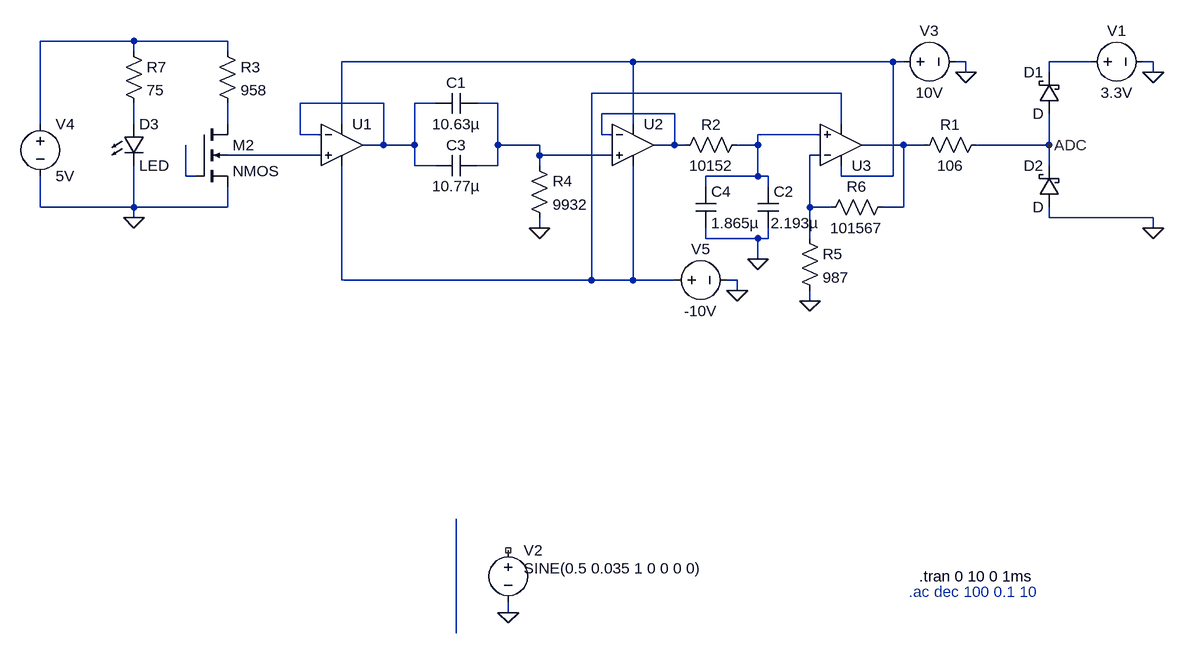
[diagram p0: schematic MeasuredValues_OPB.asc]
MeasuredValues_OPB.asc, the LTspice schematic file:
Version 4.1
SHEET 1 880 836
WIRE -896 -80 -1040 -80
WIRE -752 -80 -896 -80
WIRE -896 -64 -896 -80
WIRE -752 -64 -752 -80
WIRE -128 -48 -576 -48
WIRE 272 -48 -128 -48
WIRE 288 -48 272 -48
WIRE 384 -48 368 -48
WIRE 576 -48 512 -48
WIRE 672 -48 656 -48
WIRE 384 -32 384 -48
WIRE 512 -32 512 -48
WIRE 672 -32 672 -48
WIRE 192 0 -192 0
WIRE -512 16 -640 16
WIRE -432 16 -464 16
WIRE -336 16 -368 16
WIRE -64 32 -176 32
WIRE -1040 48 -1040 -80
WIRE -896 48 -896 16
WIRE -752 48 -752 16
WIRE -576 48 -576 -48
WIRE -128 48 -128 -48
WIRE 192 48 192 0
WIRE -640 64 -640 16
WIRE -608 64 -640 64
WIRE -176 64 -176 32
WIRE -160 64 -176 64
WIRE 160 64 64 64
WIRE -512 80 -512 16
WIRE -512 80 -544 80
WIRE -464 80 -464 16
WIRE -464 80 -512 80
WIRE -336 80 -336 16
WIRE -272 80 -336 80
WIRE -64 80 -64 32
WIRE -64 80 -96 80
WIRE -48 80 -64 80
WIRE 64 80 64 64
WIRE 64 80 32 80
WIRE 288 80 224 80
WIRE 320 80 288 80
WIRE 512 80 512 32
WIRE 512 80 400 80
WIRE -608 96 -752 96
WIRE -272 96 -272 80
WIRE -160 96 -272 96
WIRE 160 96 144 96
WIRE -464 112 -464 80
WIRE -432 112 -464 112
WIRE -336 112 -336 80
WIRE -336 112 -368 112
WIRE -272 112 -272 96
WIRE 512 112 512 80
WIRE -816 128 -816 80
WIRE -800 128 -816 128
WIRE 64 128 64 80
WIRE 64 128 -16 128
WIRE 80 128 64 128
WIRE 192 128 192 112
WIRE 272 128 272 -48
WIRE 272 128 192 128
WIRE -16 144 -16 128
WIRE 80 144 80 128
WIRE -1040 176 -1040 128
WIRE -896 176 -896 112
WIRE -896 176 -1040 176
WIRE -752 176 -752 144
WIRE -752 176 -896 176
WIRE 144 176 144 96
WIRE 176 176 144 176
WIRE 288 176 288 80
WIRE 288 176 256 176
WIRE -896 192 -896 176
WIRE 512 192 512 176
WIRE 672 192 512 192
WIRE -272 208 -272 192
WIRE 672 208 672 192
WIRE -16 224 -16 208
WIRE 64 224 -16 224
WIRE 80 224 80 208
WIRE 80 224 64 224
WIRE 144 224 144 176
WIRE 64 256 64 224
WIRE -576 288 -576 112
WIRE -192 288 -192 0
WIRE -192 288 -576 288
WIRE -128 288 -128 112
WIRE -128 288 -192 288
WIRE -64 288 -128 288
WIRE 32 288 16 288
WIRE 32 304 32 288
WIRE 144 320 144 304
WIRE -320 800 -320 784
WIRE -400 832 -400 656
FLAG 672 208 0
FLAG 672 -32 0
FLAG -272 208 0
FLAG 64 256 0
FLAG 144 320 0
FLAG 512 80 ADC
FLAG 384 -32 0
FLAG 32 304 0
FLAG -320 800 0
FLAG -896 192 0
SYMBOL schottky 528 176 R180
WINDOW 0 24 64 Left 2
WINDOW 3 24 0 Left 2
SYMATTR InstName D2
SYMBOL schottky 528 32 R180
WINDOW 0 24 64 Left 2
WINDOW 3 24 0 Left 2
SYMATTR InstName D1
SYMBOL res 416 64 R90
WINDOW 0 0 56 VBottom 2
WINDOW 3 32 56 VTop 2
SYMATTR InstName R1
SYMATTR Value 106
SYMBOL voltage 560 -48 R270
WINDOW 0 32 56 VTop 2
WINDOW 3 -32 56 VBottom 2
SYMATTR InstName V1
SYMATTR Value 3.3V
SYMBOL voltage -320 688 R0
WINDOW 123 24 124 Left 2
WINDOW 39 0 0 Left 0
WINDOW 3 24 44 Left 2
SYMATTR Value SINE(0.5 0.035 1 0 0 0 0)
SYMATTR InstName V2
SYMBOL OpAmps\\UniversalOpAmp -576 80 R0
SYMATTR InstName U1
SYMBOL OpAmps\\UniversalOpAmp -128 80 R0
SYMATTR InstName U2
SYMBOL res 48 64 R90
WINDOW 0 0 56 VBottom 2
WINDOW 3 32 56 VTop 2
SYMATTR InstName R2
SYMATTR Value 10152
SYMBOL cap -368 0 R90
WINDOW 0 0 32 VBottom 2
WINDOW 3 32 32 VTop 2
SYMATTR InstName C1
SYMATTR Value 10.63µ
SYMBOL res -288 96 R0
SYMATTR InstName R4
SYMATTR Value 9932
SYMBOL cap 64 144 R0
WINDOW 3 20 56 Left 2
SYMATTR InstName C2
SYMATTR Value 2.193µ
SYMBOL OpAmps\\UniversalOpAmp 192 80 M180
SYMATTR InstName U3
SYMBOL res 128 208 R0
SYMATTR InstName R5
SYMATTR Value 987
SYMBOL res 272 160 R90
WINDOW 0 0 56 VBottom 2
WINDOW 3 32 56 VTop 2
SYMATTR InstName R6
SYMATTR Value 101567
SYMBOL voltage 272 -48 R270
WINDOW 0 32 56 VTop 2
WINDOW 3 -32 56 VBottom 2
SYMATTR InstName V3
SYMATTR Value 10V
SYMBOL voltage -80 288 R270
WINDOW 0 32 56 VTop 2
WINDOW 3 -32 56 VBottom 2
SYMATTR InstName V5
SYMATTR Value -10V
SYMBOL cap -368 96 R90
WINDOW 0 0 32 VBottom 2
WINDOW 3 32 32 VTop 2
SYMATTR InstName C3
SYMATTR Value 10.77µ
SYMBOL cap -32 144 R0
SYMATTR InstName C4
SYMATTR Value 1.865µ
SYMBOL LED -912 48 R0
SYMATTR InstName D3
SYMATTR Value LED
SYMBOL res -768 -80 R0
SYMATTR InstName R3
SYMATTR Value 958
SYMBOL res -912 -80 R0
SYMATTR InstName R7
SYMATTR Value 75
SYMBOL voltage -1040 32 R0
SYMATTR InstName V4
SYMATTR Value 5V
SYMBOL nmos4 -800 48 R0
SYMATTR InstName M2
TEXT 312 744 Left 2 !.tran 0 10 0 1ms
TEXT 296 768 Left 2 ;.ac dec 100 0.1 10

The netlist it stands for:
* MeasuredValues_OPB.asc
D2 0 ADC D
D1 ADC N003 D
R1 ADC N011 106
V1 N003 0 3.3V
V2 NC_01 0 SINE(0.5 0.035 1 0 0 0 0)
X§U1 N012 N005 N002 N004 N005 level1 Avol=1Meg GBW=10Meg Vos=0 En=0 Enk=0 In=0 Ink=0 Rin=500Meg  ; pins In+ In- V+ V- OUT
X§U2 N006 N007 N002 N004 N007 level1 Avol=1Meg GBW=10Meg Vos=0 En=0 Enk=0 In=0 Ink=0 Rin=500Meg  ; pins In+ In- V+ V- OUT
R2 N010 N007 10152
C1 N006 N005 10.63µ
R4 N006 0 9932
C2 N010 0 2.193µ
X§U3 N010 N013 N002 N004 N011 level1 Avol=1Meg GBW=10Meg Vos=0 En=0 Enk=0 In=0 Ink=0 Rin=500Meg  ; pins In+ In- V+ V- OUT
R5 N013 0 987
R6 N011 N013 101567
V3 N002 0 10V
V5 N004 0 -10V
C3 N006 N005 10.77µ
C4 N010 0 1.865µ
D3 N008 0 LED
R3 N001 N009 958
R7 N001 N008 75
V4 N001 0 5V
M2 N009 N014 0 N012 NMOS
.model D D
.lib standard.dio
.model NMOS NMOS
.model PMOS PMOS
.lib standard.mos
.tran 0 10 0 1ms
* .ac dec 100 0.1 10
.lib UniversalOpAmp1.lib
.backanno
.end